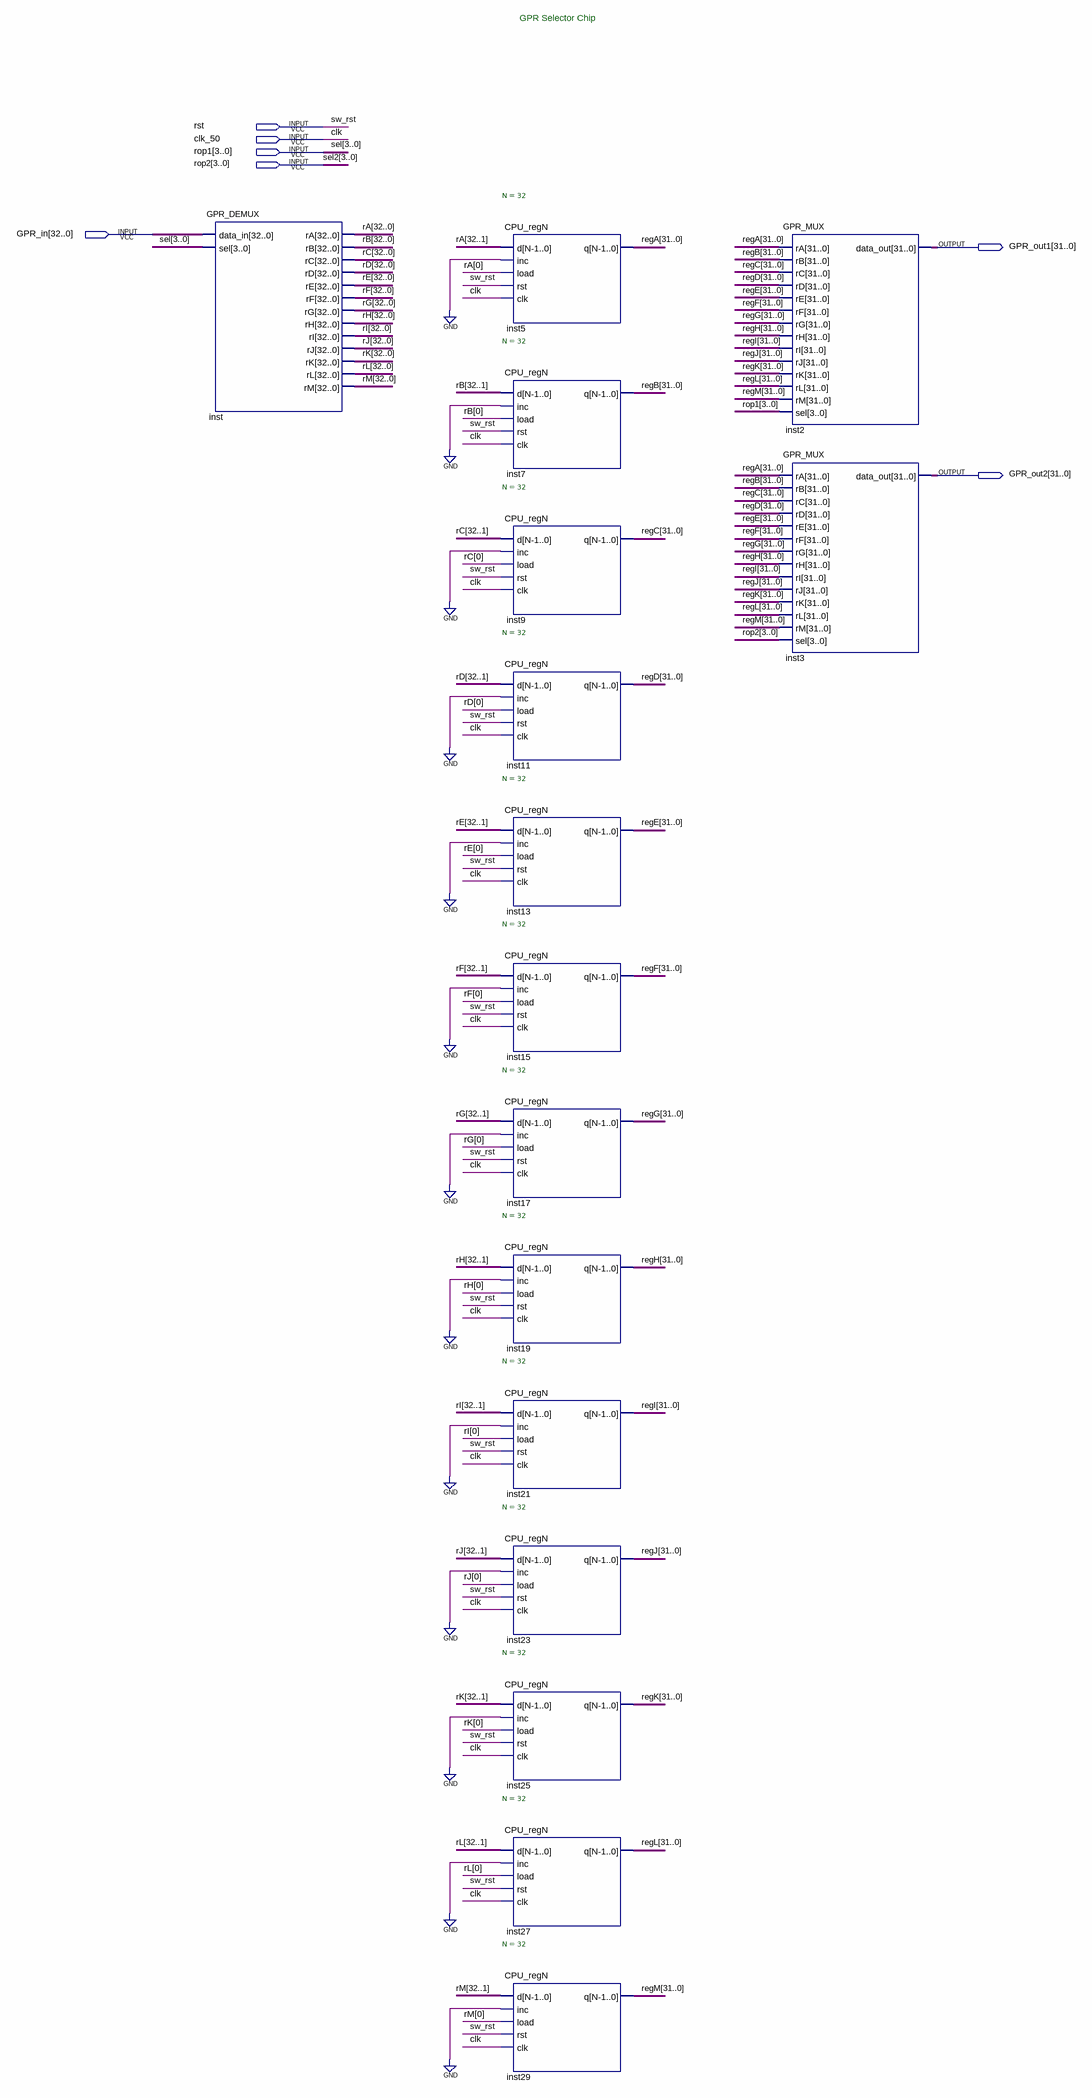
[diagram p0: schematic sheet]
// Quartus schematic GPR_selector.bdf as structural Verilog: 16 symbols, 7 pins
module GPR_selector (
  input  rst,
  input  clk_50,
  input  [3:0] rop1,
  input  [3:0] rop2,
  input  [32:0] GPR_in,
  output [31:0] GPR_out1,
  output [31:0] GPR_out2
);

  wire [31:0] regA, regB, regC, regD, regE, regF, regG, regH, regI, regJ, regK, regL, regM;
  wire [32:0] rA, rB, rC, rD, rE, rF, rG, rH, rI, rJ, rK, rL, rM;

  GPR_DEMUX inst (
    .data_in(GPR_in), .sel(rop1), .rA(rA), .rB(rB), .rC(rC), .rD(rD), .rE(rE), .rF(rF), .rG(rG), .rH(rH),
    .rI(rI), .rJ(rJ), .rK(rK), .rL(rL), .rM(rM));
  CPU_regN #(.N(32)) inst5 (.d(rA[32:1]), .inc(1'b0), .load(rA[0]), .rst(rst), .clk(clk_50), .q(regA));
  CPU_regN #(.N(32)) inst7 (.d(rB[32:1]), .inc(1'b0), .load(rB[0]), .rst(rst), .clk(clk_50), .q(regB));
  CPU_regN #(.N(32)) inst9 (.d(rC[32:1]), .inc(1'b0), .load(rC[0]), .rst(rst), .clk(clk_50), .q(regC));
  CPU_regN #(.N(32)) inst11 (.d(rD[32:1]), .inc(1'b0), .load(rD[0]), .rst(rst), .clk(clk_50), .q(regD));
  CPU_regN #(.N(32)) inst13 (.d(rE[32:1]), .inc(1'b0), .load(rE[0]), .rst(rst), .clk(clk_50), .q(regE));
  CPU_regN #(.N(32)) inst15 (.d(rF[32:1]), .inc(1'b0), .load(rF[0]), .rst(rst), .clk(clk_50), .q(regF));
  CPU_regN #(.N(32)) inst17 (.d(rG[32:1]), .inc(1'b0), .load(rG[0]), .rst(rst), .clk(clk_50), .q(regG));
  CPU_regN #(.N(32)) inst19 (.d(rH[32:1]), .inc(1'b0), .load(rH[0]), .rst(rst), .clk(clk_50), .q(regH));
  CPU_regN #(.N(32)) inst21 (.d(rI[32:1]), .inc(1'b0), .load(rI[0]), .rst(rst), .clk(clk_50), .q(regI));
  CPU_regN #(.N(32)) inst23 (.d(rJ[32:1]), .inc(1'b0), .load(rJ[0]), .rst(rst), .clk(clk_50), .q(regJ));
  CPU_regN #(.N(32)) inst25 (.d(rK[32:1]), .inc(1'b0), .load(rK[0]), .rst(rst), .clk(clk_50), .q(regK));
  CPU_regN #(.N(32)) inst27 (.d(rL[32:1]), .inc(1'b0), .load(rL[0]), .rst(rst), .clk(clk_50), .q(regL));
  CPU_regN #(.N(32)) inst29 (.d(rM[32:1]), .inc(1'b0), .load(rM[0]), .rst(rst), .clk(clk_50), .q(regM));
  GPR_MUX inst2 (
    .rA(regA), .rB(regB), .rC(regC), .rD(regD), .rE(regE), .rF(regF), .rG(regG), .rH(regH), .rI(regI),
    .rJ(regJ), .rK(regK), .rL(regL), .rM(regM), .sel(rop1), .data_out(GPR_out1));
  GPR_MUX inst3 (
    .rA(regA), .rB(regB), .rC(regC), .rD(regD), .rE(regE), .rF(regF), .rG(regG), .rH(regH), .rI(regI),
    .rJ(regJ), .rK(regK), .rL(regL), .rM(regM), .sel(rop2), .data_out(GPR_out2));

  // Other names for the same wires on the sheet: clk = clk_50; sel[3:0] = rop1; sel2[3:0] = rop2; sw_rst = rst

  // Notes on the sheet:
  //   GPR Selector Chip
endmodule
